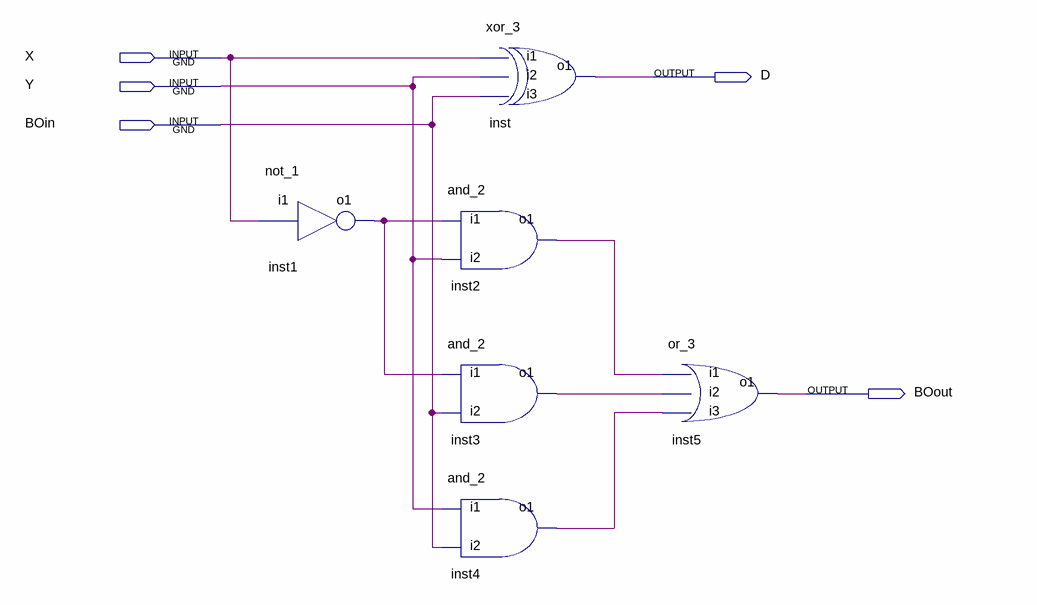
[diagram p0: schematic sheet]
// Quartus schematic FS.bdf as structural Verilog: 6 symbols, 5 pins
module FS (
  input  X,
  input  Y,
  input  BOin,
  output D,
  output BOout
);

  wire inst1_o1, inst2_o1, inst3_o1, inst4_o1;

  not_1 inst1 (.i1(X), .o1(inst1_o1));
  xor_3 inst (.i1(X), .i2(Y), .i3(BOin), .o1(D));
  and_2 inst2 (.i1(inst1_o1), .i2(Y), .o1(inst2_o1));
  and_2 inst3 (.i1(inst1_o1), .i2(BOin), .o1(inst3_o1));
  and_2 inst4 (.i1(Y), .i2(BOin), .o1(inst4_o1));
  or_3 inst5 (.i1(inst2_o1), .i2(inst3_o1), .i3(inst4_o1), .o1(BOout));
endmodule
